# Altium schematic sheet [3] Sensors.SchDoc
size A4; SheetNumber: 3; SheetTotal: 3
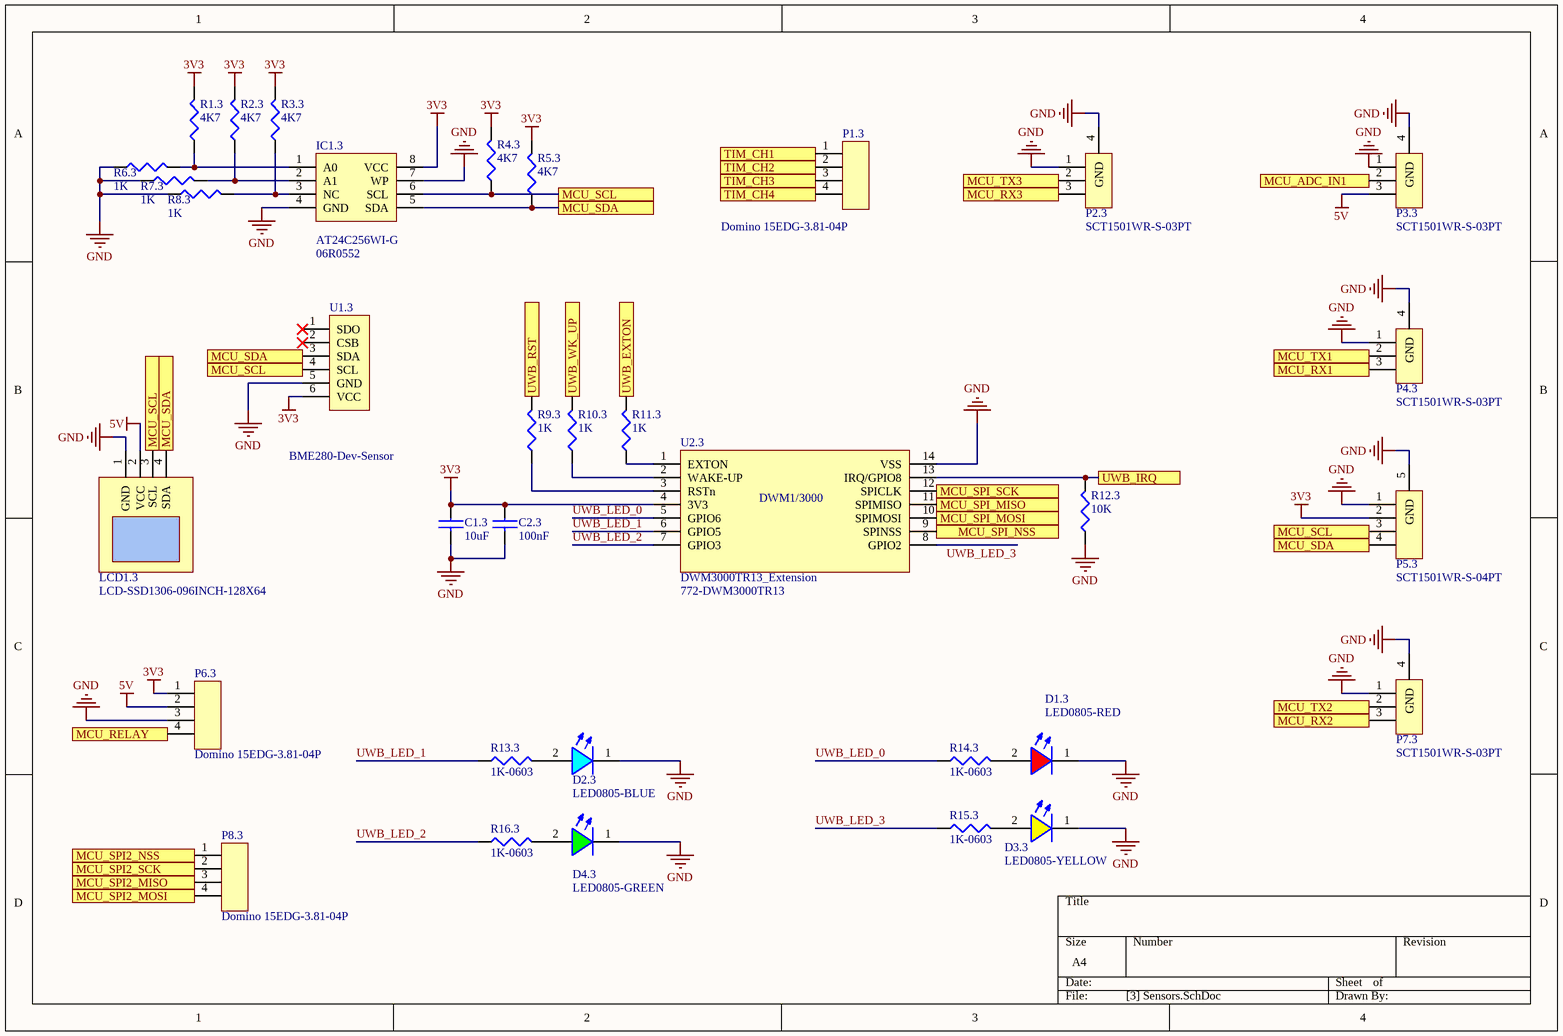
[diagram p0: [3] Sensors.SchDoc]

## Parts
C1.3  10uF  [CAP0603]
C2.3  100nF  [CAP0603]
D1.3  LED0805-RED  [LED0805-RED]
D2.3  LED0805-BLUE  [LED0805-BLUE]
D3.3  LED0805-YELLOW  [LED0805-YELLOW]
D4.3  LED0805-GREEN  [LED0805-GREEN]
IC1.3  AT24C256WI-G  Supplier Part Number 1: 06R0552  [SOP8]
LCD1.3  LCD-SSD1306-096INCH-128X64  [LCD128X64-SSD1306]
P1.3  Domino 15EDG-3.81-04P  [DOMINO 15EDG3.81 4P]
P2.3  SCT1501WR-S-03PT  [Connector ZH1.5 3P SMD]
P3.3  SCT1501WR-S-03PT  [Connector ZH1.5 3P SMD]
P4.3  SCT1501WR-S-03PT  [Connector ZH1.5 3P SMD]
P5.3  SCT1501WR-S-04PT  [Connector ZH1.5 4P SMD]
P6.3  Domino 15EDG-3.81-04P  [DOMINO 15EDG3.81 4P]
P7.3  SCT1501WR-S-03PT  [Connector ZH1.5 3P SMD]
P8.3  Domino 15EDG-3.81-04P  [DOMINO 15EDG3.81 4P]
R1.3  4K7  [RES0603 - 3D]
R2.3  4K7  [RES0603 - 3D]
R3.3  4K7  [RES0603 - 3D]
R4.3  4K7  [RES0603 - 3D]
R5.3  4K7  [RES0603 - 3D]
R6.3  1K  [RES0603 - 3D]
R7.3  1K  [RES0603 - 3D]
R8.3  1K  [RES0603 - 3D]
R9.3  1K  [RES0603 - 3D]
R10.3  1K  [RES0603 - 3D]
R11.3  1K  [RES0603 - 3D]
R12.3  10K  [RES0603 - 3D]
R13.3  1K-0603  [RES0603 - 3D]
R14.3  1K-0603  [RES0603 - 3D]
R15.3  1K-0603  [RES0603 - 3D]
R16.3  1K-0603  [RES0603 - 3D]
U1.3  BME280-Dev-Sensor  [bme280]
U2.3  DWM3000TR13_Extension  Supplier Part Number 1: 772-DWM3000TR13  [DWM3000-EXTEN-PAD]

## Ports
MCU_ADC_IN1, MCU_RELAY, MCU_RX1, MCU_RX2, MCU_RX3, MCU_SCL, MCU_SDA, MCU_SPI2_MISO, MCU_SPI2_MOSI, MCU_SPI2_NSS, MCU_SPI2_SCK, MCU_SPI_MISO, MCU_SPI_MOSI, MCU_SPI_NSS, MCU_SPI_SCK, MCU_TX1, MCU_TX2, MCU_TX3, TIM_CH1, TIM_CH2, TIM_CH3, TIM_CH4, UWB_EXTON, UWB_IRQ, UWB_RST, UWB_WK_UP

## Nets
3V3: C1.3.1 C2.3.1 IC1.3.8(VCC) P5.3.2 P6.3.1 R1.3.2 R2.3.2 R3.3.2 R4.3.2 R5.3.2 U1.3.6(VCC) U2.3.4(3V3)
5V: LCD1.3.2(VCC) P3.3.3 P6.3.2
GND: C1.3.2 C2.3.2 D1.3.1(+) D2.3.1(+) D3.3.1(+) D4.3.1(+) IC1.3.4(GND) IC1.3.7(WP) LCD1.3.1(GND) P2.3.1 P2.3.4(GND) P3.3.1 P3.3.4(GND) P4.3.1 P4.3.4(GND) P5.3.1 P5.3.5(GND) P6.3.3 P7.3.1 P7.3.4(GND) R6.3.1 R7.3.1 R8.3.1 R12.3.1 U1.3.5(GND) U2.3.14(VSS)
MCU_ADC_IN1: P3.3.2 ; port MCU_ADC_IN1
MCU_RELAY: P6.3.4 ; port MCU_RELAY
MCU_RX1: P4.3.3 ; port MCU_RX1
MCU_RX2: P7.3.3 ; port MCU_RX2
MCU_RX3: P2.3.3 ; port MCU_RX3
MCU_SCL: IC1.3.6(SCL) LCD1.3.3(SCL) P5.3.3 R4.3.1 U1.3.4(SCL) ; port MCU_SCL
MCU_SDA: IC1.3.5(SDA) LCD1.3.4(SDA) P5.3.4 R5.3.1 U1.3.3(SDA) ; port MCU_SDA
MCU_SPI2_MISO: P8.3.3 ; port MCU_SPI2_MISO
MCU_SPI2_MOSI: P8.3.4 ; port MCU_SPI2_MOSI
MCU_SPI2_NSS: P8.3.1 ; port MCU_SPI2_NSS
MCU_SPI2_SCK: P8.3.2 ; port MCU_SPI2_SCK
MCU_SPI_MISO: U2.3.11(SPIMISO) ; port MCU_SPI_MISO
MCU_SPI_MOSI: U2.3.10(SPIMOSI) ; port MCU_SPI_MOSI
MCU_SPI_NSS: U2.3.9(SPINSS) ; port MCU_SPI_NSS
MCU_SPI_SCK: U2.3.12(SPICLK) ; port MCU_SPI_SCK
MCU_TX1: P4.3.2 ; port MCU_TX1
MCU_TX2: P7.3.2 ; port MCU_TX2
MCU_TX3: P2.3.2 ; port MCU_TX3
TIM_CH1: P1.3.1 ; port TIM_CH1
TIM_CH2: P1.3.2 ; port TIM_CH2
TIM_CH3: P1.3.3 ; port TIM_CH3
TIM_CH4: P1.3.4 ; port TIM_CH4
UWB_EXTON: R11.3.2 ; port UWB_EXTON
UWB_IRQ: R12.3.2 U2.3.13(IRQ/GPIO8) ; port UWB_IRQ
UWB_LED_0: R14.3.1 U2.3.5(GPIO6)
UWB_LED_1: R13.3.1 U2.3.6(GPIO5)
UWB_LED_2: R16.3.1 U2.3.7(GPIO3)
UWB_LED_3: R15.3.1 U2.3.8(GPIO2)
UWB_RST: R9.3.2 ; port UWB_RST
UWB_WK_UP: R10.3.2 ; port UWB_WK_UP
NetD1.3_2: D1.3.2(+) R14.3.2
NetD2.3_2: D2.3.2(+) R13.3.2
NetD3.3_2: D3.3.2(+) R15.3.2
NetD4.3_2: D4.3.2(+) R16.3.2
NetIC1.3_1: IC1.3.1(A0) R1.3.1 R6.3.2
NetIC1.3_2: IC1.3.2(A1) R2.3.1 R7.3.2
NetIC1.3_3: IC1.3.3(NC) R3.3.1 R8.3.2
NetR9.3_1: R9.3.1 U2.3.3(RSTn)
NetR10.3_1: R10.3.1 U2.3.2(WAKE-UP)
NetR11.3_1: R11.3.1 U2.3.1(EXTON)

Not connected (* = marked no-connect by the designer): U1.3 1(SDO)* 2(CSB)*

## Notes on the sheet
- (in symbol DWM3000TR13_Extension) DWM1/3000

## Library data of the parts
C1.3 = CC0603KRX5R6BB106: CAP CER 10UF 10V X5R 0603; Manufacturer 1: Yageo; Category 1: Capacitors; Capacitance: 10µF; Tolerance: ±10%; Supplier 1: Digi-Key; Supplier Part Number 1: 311-1782-1-ND; Manufacturer Part Number 1: CC0603KRX5R6BB106; RoHS 1: RoHS Compliant; Description 1: CAP CER 10UF 10V X5R 0603; Stock 1: 66566; Pricing 1: 1=0.33, 10=0.225, 100=0.1272, 500=0.08982, 1000=0.07858 (USD); Packaging: Cut Tape (CT); Part Status: Active; Voltage - Rated: 10V; Temperature Coefficient: X5R; Operating Temperature: -55°C ~ 85°C; Features: -; Ratings: -; Applications: General Purpose; Failure Rate: -; Mounting Type: Surface Mount, MLCC; Package / Case: 0603 (1608 Metric); Size / Dimension: 0.063" L x 0.031" W (1.60mm x 0.80mm); Height - Seated (Max): -; Thickness (Max): 0.035" (0.90mm); Lead Spacing: -; Lead Style: -; ComponentLink1URL: http://www.yageo.com/documents/recent/UPY-GPHC_X5R_4V-to-50V_24.pdf; ComponentLink1Description: http://www.yageo.com/documents/recent/UPY-GPHC_X5R_4V-to-50V_24.pdf; Value: 10uF
C2.3 = CC0603KRX7R0BB104: CAP CER 0.1UF 100V X7R 0603; Manufacturer: Yageo; Tolerance: ±10%; Supplier 1: Digi-Key; Manufacturer Part Number: CC0603KRX7R0BB104; RoHS: RoHS Compliant; Category: Capacitors; Stock 1: 784508; Pricing 1: 1=0.23, 10=0.156, 100=0.0791, 500=0.05414, 1000=0.0479 (USD); Packaging: Cut Tape (CT); Part Status: Active; Temperature Coefficient: X7R; Operating Temperature: -55°C ~ 125°C; Features: -; Ratings: -; Applications: General Purpose; Failure Rate: -; Mounting Type: Surface Mount, MLCC; Package / Case: 0603 (1608 Metric); Size / Dimension: 0.063" L x 0.032" W (1.60mm x 0.80mm); Height - Seated (Max): -; Thickness (Max): 0.035" (0.90mm); Lead Spacing: -; Lead Style: -; ComponentLink1URL: http://media.digikey.com/pdf/Data%20Sheets/Yageo%20PDFs/NPO,%20X7R%20Mid-voltage.pdf; ComponentLink1Description: http://media.digikey.com/pdf/Data%20Sheets/Yageo%20PDFs/NPO,%20X7R%20Mid-voltage.pdf; Supplier Part Number 1: 311-1523-1-ND; Value: 100nF; Voltage - Rated: 100V
IC1.3 = AT24C256WI-G: CAT24C256 Series 256 Kb (32K X 8)  1.8 V - 5.5 V I2C CMOS Serial EEPROM - SOIC-8; Manufacturer: ON Semiconductor; Manufacturer Part Number: CAT24C256WI-G; Frequency: 400kHz; Access Time: 500ns; Memory Size: 256Kb; Interface: I2C,Serial; Max Supply Voltage: 5.5V; Min Supply Voltage: 1.8V; Memory Type: Non-Volatile,EEPROM; Max Frequency: 100kHz; Nominal Supply Current: 3mA; Access Time-Max: 900ns; Organization: 32KX8; Write Protection: YES; Operating Supply Voltage: 5V; Write Cycle Time-Max (tWC): 5ms; Supplier 1: Newark; RoHS: Yes; Category: EEPROM; Mount: Surface Mount; Case/Package: SOIC; Number of Pins: 8; Contact Plating: Gold; Min Operating Temperature: -40°C; Max Operating Temperature: 85°C; Packaging: Rail/Tube; Package Quantity: 100; Series: -; Density: 256Kb; Supply Current: 3mA; Supply Voltage-Nom: 5.5V; Radiation Hardening: No; Lead Free: Lead Free; RoHS Compliant: Yes; Reach SVHC Compliant: Yes; ComponentLink1URL: https://datasheet.ciiva.com/1166/cat24c256-d-1166416.pdf?src-supplier=Newark; ComponentLink1Description: https://datasheet.ciiva.com/1166/cat24c256-d-1166416.pdf?src-supplier=Newark; ComponentLink2URL: https://datasheet.ciiva.com/15123/getdatasheetpartid-257691-15123320.pdf?src-supplier=Verical; ComponentLink2Description: https://datasheet.ciiva.com/15123/getdatasheetpartid-257691-15123320.pdf?src-supplier=Verical; ComponentLink3URL: https://datasheet.ciiva.com/5700/cat24c256-d-5700793.pdf?src-supplier=Farnell; ComponentLink3Description: https://datasheet.ciiva.com/5700/cat24c256-d-5700793.pdf?src-supplier=Farnell; ComponentLink4URL: https://datasheet.ciiva.com/8072/cat24c256-d-8072141.pdf?src-supplier=Element14; ComponentLink4Description: https://datasheet.ciiva.com/8072/cat24c256-d-8072141.pdf?src-supplier=Element14; ComponentLink5URL: https://datasheet.ciiva.com/4859/cat24c256-d-105771-4859399.pdf?src-supplier=Mouser; ComponentLink5Description: https://datasheet.ciiva.com/4859/cat24c256-d-105771-4859399.pdf?src-supplier=Mouser; ComponentLink6URL: https://datasheet.ciiva.com/3185/cat24c256-d-3185116.pdf?src-supplier=Avnet; ComponentLink6Description: https://datasheet.ciiva.com/3185/cat24c256-d-3185116.pdf?src-supplier=Avnet; ComponentLink7URL: https://datasheet.ciiva.com/16456/cat24c256-d-16456381.pdf?src-supplier=Future+Electronics; ComponentLink7Description: https://datasheet.ciiva.com/16456/cat24c256-d-16456381.pdf?src-supplier=Future+Electronics; ComponentLink8URL: https://datasheet.ciiva.com/1912/cat24c256-d-1912247.pdf?src-supplier=Digi-Key; ComponentLink8Description: https://datasheet.ciiva.com/1912/cat24c256-d-1912247.pdf?src-supplier=Digi-Key
R1.3 R2.3 R3.3 R4.3 R5.3 = RC0603JR-074K7L: RES SMD 4.7K OHM 5% 1/10W 0603; Manufacturer: Yageo; Power (Watts): 0.1W, 1/10W; Temperature Coefficient: ±100ppm/°C; Supplier 1: Digi-Key; Manufacturer Part Number: RC0603JR-074K7L; RoHS: RoHS Compliant; Category: Resistors; Stock 1: 4925196; Pricing 1: 1=0.1, 10=0.011, 100=0.0046, 1000=0.00207, 2500=0.0018 (USD); Packaging: Cut Tape (CT); Part Status: Active; Tolerance: ±5%; Composition: Thick Film; Features: Moisture Resistant; Operating Temperature: -55°C ~ 155°C; Package / Case: 0603 (1608 Metric); Supplier Device Package: 0603; Size / Dimension: 0.063" L x 0.032" W (1.60mm x 0.80mm); Height - Seated (Max): 0.022" (0.55mm); Failure Rate: -; ComponentLink1URL: http://www.yageo.com/documents/recent/PYu-RC_Group_51_RoHS_L_7.pdf; ComponentLink1Description: http://www.yageo.com/documents/recent/PYu-RC_Group_51_RoHS_L_7.pdf; Supplier Part Number 1: 311-4.7KGRCT-ND; Value: 4K7
R6.3 R7.3 R8.3 R9.3 R10.3 R11.3 R13.3 R14.3 R15.3 R16.3 = RC0603JR-071KL: RES SMD 1K OHM 5% 1/10W 0603; Manufacturer 1: Yageo; Category 1: Resistors; Power (Watts): 0.1W, 1/10W; Temperature Coefficient: ±100ppm/°C; Supplier 1: Digi-Key; Supplier Part Number 1: 311-1.0KGRCT-ND; Manufacturer Part Number 1: RC0603JR-071KL; RoHS 1: RoHS Compliant; Description 1: RES SMD 1K OHM 5% 1/10W 0603; Stock 1: 2853955; Pricing 1: 1=0.1, 10=0.011, 100=0.0044, 1000=0.00198, 2500=0.00172 (USD); Packaging: Cut Tape (CT); Part Status: Active; Resistance (Ohms): 1k; Tolerance: ±5%; Composition: Thick Film; Features: Moisture Resistant; Operating Temperature: -55°C ~ 155°C; Package / Case: 0603 (1608 Metric); Supplier Device Package: 0603; Size / Dimension: 0.063" L x 0.031" W (1.60mm x 0.80mm); Height - Seated (Max): 0.022" (0.55mm); Failure Rate: -; ComponentLink1URL: http://www.yageo.com/documents/recent/PYu-RC_Group_51_RoHS_L_7.pdf; ComponentLink1Description: http://www.yageo.com/documents/recent/PYu-RC_Group_51_RoHS_L_7.pdf; Value: 1K
R12.3 = RC0603JR-0710KL: RES SMD 10K OHM 5% 1/10W 0603; Manufacturer 1: Yageo; Category 1: Resistors; Power (Watts): 0.1W, 1/10W; Temperature Coefficient: ±100ppm/°C; Supplier 1: Digi-Key; Supplier Part Number 1: 311-10KGRCT-ND; Manufacturer Part Number 1: RC0603JR-0710KL; RoHS 1: RoHS Compliant; Description 1: RES SMD 10K OHM 5% 1/10W 0603; Stock 1: 3056463; Pricing 1: 1=0.1, 10=0.011, 100=0.0044, 1000=0.00198, 2500=0.00172 (USD); Packaging: Cut Tape (CT); Part Status: Active; Resistance (Ohms): 10k; Tolerance: ±5%; Composition: Thick Film; Features: Moisture Resistant; Operating Temperature: -55°C ~ 155°C; Package / Case: 0603 (1608 Metric); Supplier Device Package: 0603; Size / Dimension: 0.063" L x 0.031" W (1.60mm x 0.80mm); Height - Seated (Max): 0.022" (0.55mm); Failure Rate: -; ComponentLink1URL: http://www.yageo.com/documents/recent/PYu-RC_Group_51_RoHS_L_7.pdf; ComponentLink1Description: http://www.yageo.com/documents/recent/PYu-RC_Group_51_RoHS_L_7.pdf; Value: 10K
U2.3 = DWM3000TR13_Extension: UWB Transceiver Module; Manufacturer: Qorvo; Supplier 1: Mouser; Manufacturer Part Number: DWM3000TR13; RoHS: Yes; Category: RF Receivers, Transceivers; Stock 1: 12093; Pricing 1: 1=23.62, 10=23.62, 50=20.19, 100=17.18, 1000=12.71, 10000=12.71 (USD)